# EAGLE design ckt1 (EAGLE 9.4.2)
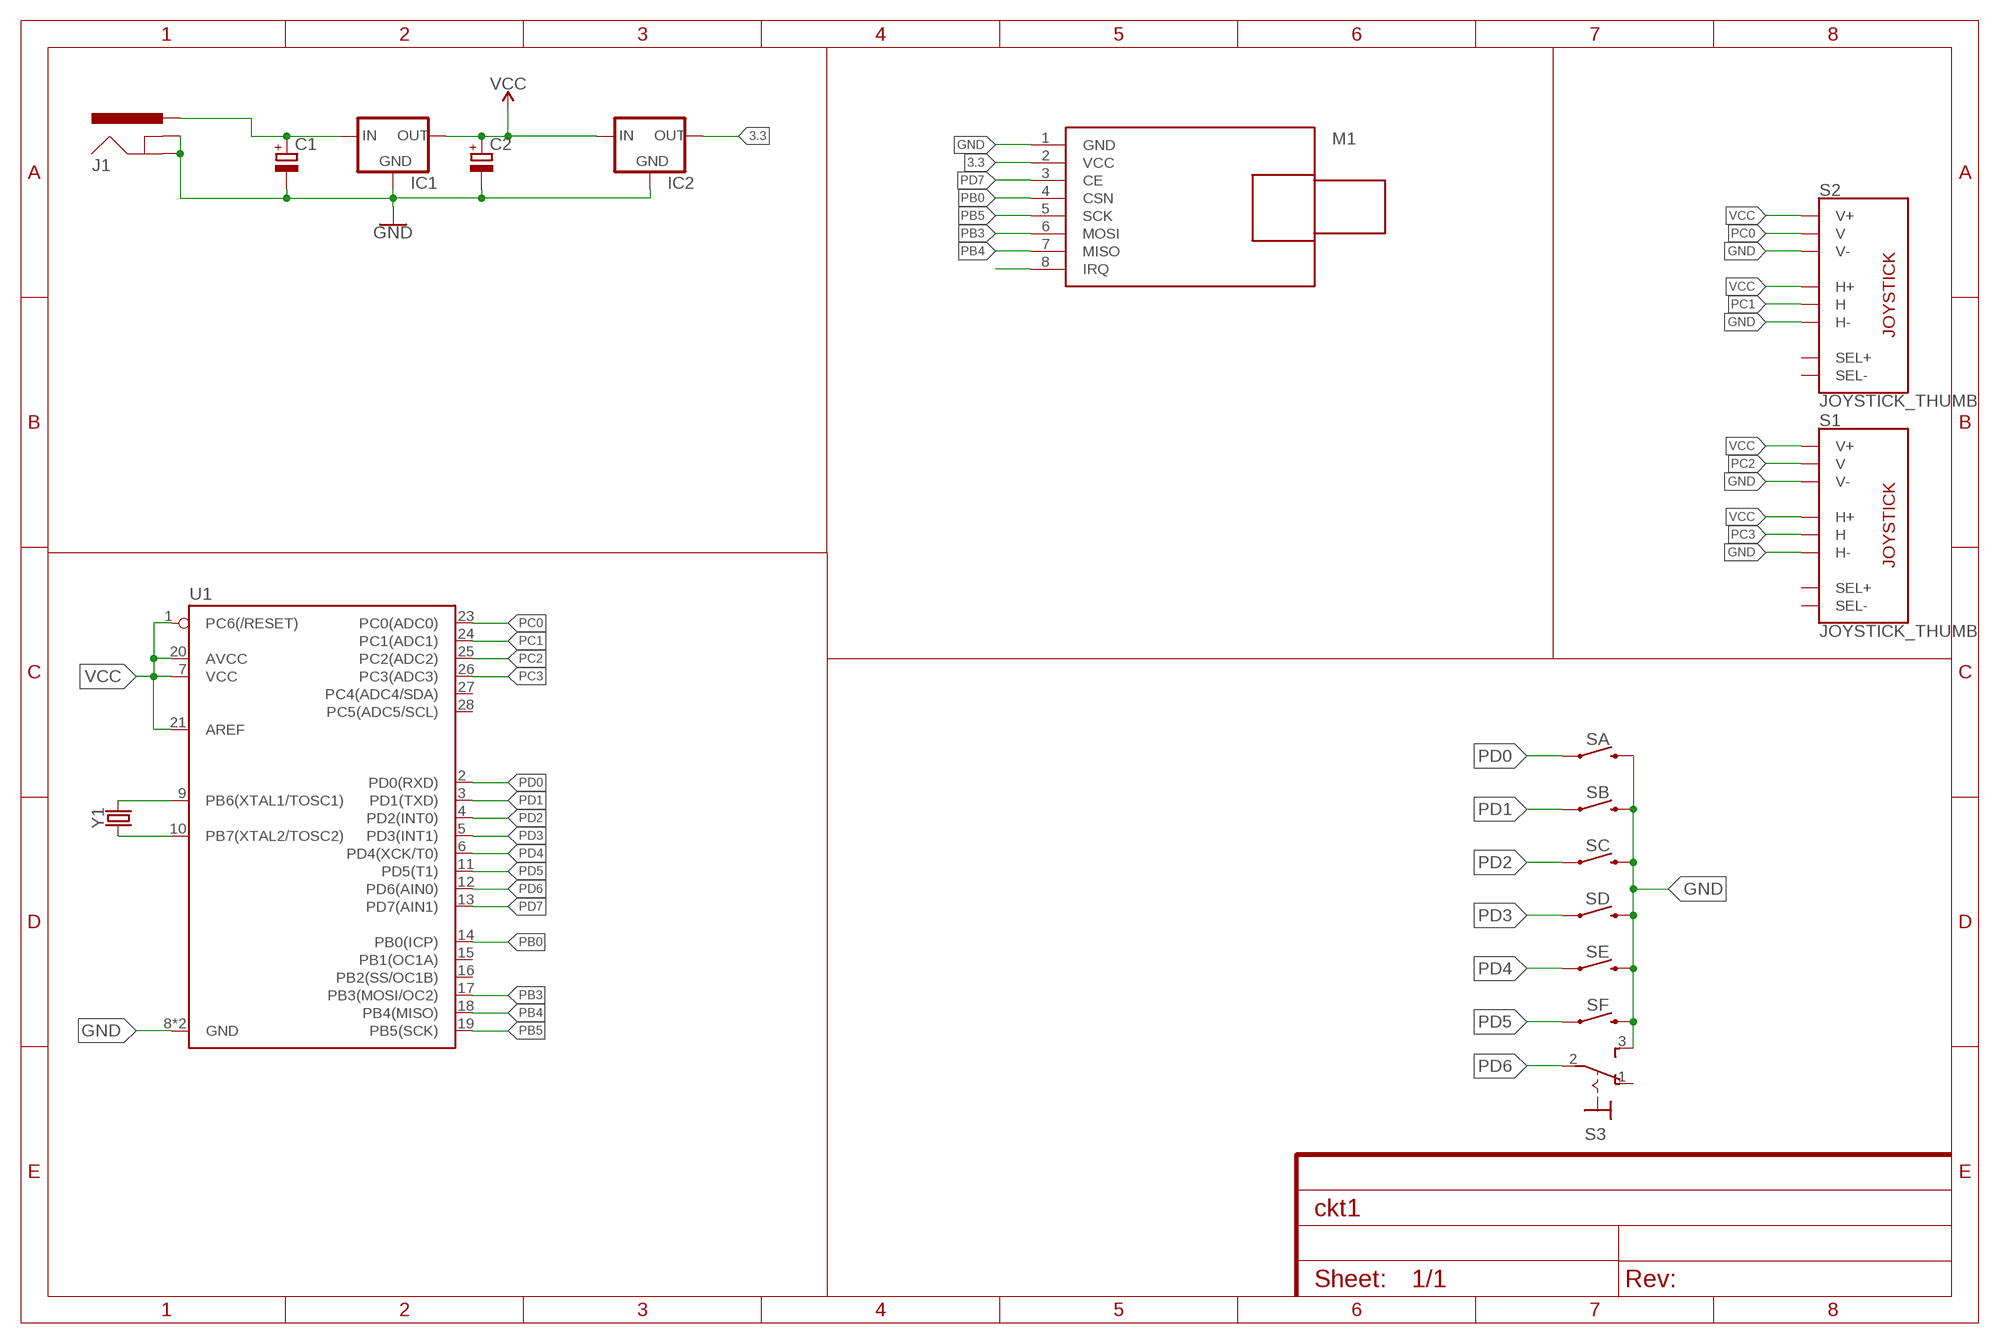
[diagram p0: schematic, sheet 1]

## Parts
C1  CPOL-EUE2-5  [E2-5]
C2  CPOL-EUE2-5  [E2-5]
IC1  78XXS  [78XXS]
IC2  78XXS  [78XXS]
J1  POWER_JACKSLT  [POWER_JACK_SLOT]
M1  WIRELESS-NRF24L01-PA-EXT  [WIRELESS-NRF24L01-PA-EXT]
S1  JOYSTICK_THUMB  [JOYSTICK]
S2  JOYSTICK_THUMB  [JOYSTICK]
S3  320-916  [320-916]
SA  MOMENTARY-SWITCH-SPST-PTH-6.0MM  [TACTILE_SWITCH_PTH_6.0MM]
SB  MOMENTARY-SWITCH-SPST-PTH-6.0MM  [TACTILE_SWITCH_PTH_6.0MM]
SC  MOMENTARY-SWITCH-SPST-PTH-6.0MM  [TACTILE_SWITCH_PTH_6.0MM]
SD  MOMENTARY-SWITCH-SPST-PTH-6.0MM  [TACTILE_SWITCH_PTH_6.0MM]
SE  MOMENTARY-SWITCH-SPST-PTH-6.0MM  [TACTILE_SWITCH_PTH_6.0MM]
SF  MOMENTARY-SWITCH-SPST-PTH-6.0MM  [TACTILE_SWITCH_PTH_6.0MM]
U1  328P  ATMEGA328P_PDIP  [DIP28]
Y1  CRYSTALPTH-HC49US  [HC49US]

## Nets
3.3: IC2.OUT M1.2(VCC)
GND: C1.- C2.- IC1.GND IC2.GND J1.GND@1(GNDBREAK) J1.GND@2(GND) M1.1(GND) S1.H3(H-) S1.V3(V-) S2.H3(H-) S2.V3(V-) S3.3(S) SA.3 SB.3 SC.3 SD.3 SE.3 SF.3 U1.8(GND) U1.22(GND)
N$1: U1.9(PB6(XTAL1/TOSC1)) Y1.2
N$2: C1.+ IC1.IN J1.PWR
N$3: U1.10(PB7(XTAL2/TOSC2)) Y1.1
N$8: M1.8(IRQ)
PB0: M1.4(CSN) U1.14(PB0(ICP))
PB3: M1.6(MOSI) U1.17(PB3(MOSI/OC2))
PB4: M1.7(MISO) U1.18(PB4(MISO))
PB5: M1.5(SCK) U1.19(PB5(SCK))
PC0: S2.V2(V) U1.23(PC0(ADC0))
PC1: S2.H2(H) U1.24(PC1(ADC1))
PC2: S1.V2(V) U1.25(PC2(ADC2))
PC3: S1.H2(H) U1.26(PC3(ADC3))
PD0: SA.1 U1.2(PD0(RXD))
PD1: SB.1 U1.3(PD1(TXD))
PD2: SC.1 U1.4(PD2(INT0))
PD3: SD.1 U1.5(PD3(INT1))
PD4: SE.1 U1.6(PD4(XCK/T0))
PD5: SF.1 U1.11(PD5(T1))
PD6: S3.2(P) U1.12(PD6(AIN0))
PD7: M1.3(CE) U1.13(PD7(AIN1))
VCC: C2.+ IC1.OUT IC2.IN S1.H1(H+) S1.V1(V+) S2.H1(H+) S2.V1(V+) U1.1(PC6(/RESET)) U1.7(VCC) U1.20(AVCC) U1.21(AREF)
Unconnected: S1.B1A(SEL+) S1.B2A(SEL-) S2.B1A(SEL+) S2.B2A(SEL-) S3.1(O) U1.15(PB1(OC1A)) U1.16(PB2(SS/OC1B)) U1.27(PC4(ADC4/SDA)) U1.28(PC5(ADC5/SCL))

## Library data of the parts
C1 C2 = rcl:CPOL-EU: POLARIZED CAPACITOR, European symbol; SPICEPREFIX: C
IC1 IC2 = v-reg:78XXS: VOLTAGE REGULATOR
J1 = SparkFun-Connectors:POWER_JACK: Power Jack Connector This is the standard 5.5mm barrel jack for power. The PTH is the most common, proven, reliable, footprint. The Slot footprint only works if the mill layer is transmitted to the PCB fab house so be warned. Here are the connectors we sell at SparkFun: DC Barrel Power Jack/Connector <https://www.sparkfun.com/products/119> (PRT-00119) DC Barrel Power Jack/Connector (SMD) <https://www.sparkfun.com/products/12748> (PRT-12748) DC Barrel Jack Adapter - Breadboard Compatible <https://www.sparkfun.com/products/10811> (PRT-10811) It is used on this SparkFun product (and many, many others): SparkFun RedBoard - Programmed with Arduino <https://www.sparkfun.com/products/12757> (DEV-12757) Also, if you need a mating power supply or connector, please check these out: Wall Adapter Power Supply - 9VDC 650mA <https://www.sparkfun.com/products/298> (TOL-00298) DC Barrel Jack Adapter - Male <https://www.sparkfun.com/products/10287> (PRT-10287); PROD_ID: PRT-00119
M1 = diy-modules:WIRELESS-NRF24L01-PA-EXT: 2.4 GHz Wireless Module based on NRF24L01 chip with preamplifier and external antenna Click here to find device on ebay.com <http://www.ebay.com/sch/nrf24l01+pa+lna+sma>
S1 S2 = SparkFun-Switches:JOYSTICK_THUMB: Analog Thumb Joystick This is a joystick very similar to the ‘analog’ joysticks on PS2 (PlayStation 2) controllers. Directional movements are simply two potentiometers - one for each axis. Pots are ~10k each. This joystick also has a select button that is actuated when the joystick is pressed down. SparkFun Products Thumb Joystick <https://www.sparkfun.com/products/9032> (COM-09032) SparkFun Thumb Joystick Breakout <https://www.sparkfun.com/products/9110> (BOB-09110) SparkFun Joystick Shield Kit <https://www.sparkfun.com/products/9760> (DEV-09760); PROD_ID: COMP-09744; SF_SKU: COM-09032
S3 = switch:320-916: TOGGLE SWITCH distributor RS Components
SA SB SC SD SE SF = SparkFun-Switches:MOMENTARY-SWITCH-SPST: Momentary Switch (Pushbutton) - SPST Normally-open (NO) SPST momentary switches (buttons, pushbuttons). Variants PTH-12MM - 12mm square, through-hole Momentary Pushbutton Switch - 12mm Square <https://www.sparkfun.com/products/9190> (COM-09190) PTH-6.0MM, PTH-6.0MM-KIT - 6.0mm square, through-hole Mini Pushbutton Switch <https://www.sparkfun.com/products/97> (COM-00097) KIT package intended for soldering kit's - only one side of pads' copper is exposed. PTH-RIGHT-ANGLE-KIT - Right-angle, through-hole Right Angle Tactile Button <https://www.sparkfun.com/products/10791> - Used on SparkFun BigTime Watch Kit <https://www.sparkfun.com/products/11734> SMD-12MM - 12mm square, surface-mount Tactile Button - SMD (12mm) <https://www.sparkfun.com/products/12993> (COM-12993) Used on SparkFun PicoBoard <https://www.sparkfun.com/products/11888> SMD-4.5MM - 4.5mm Square Trackball Switch Used on SparkFun Blackberry Trackballer Breakout <https://www.sparkfun.com/products/13169> SMD-4.6MMX2.8MM - 4.60mm x 2.80mm, surface mount Used on SparkFun SAMD21 Mini Breakout <https://www.sparkfun.com/products/13664> SMD-5.2MM, SMD-5.2-REDUNDANT - 5.2mm square, surface-mount Mini Pushbutton Switch - SMD <https://www.sparkfun.com/products/8720> (COM-08720) Used on Arduino Pro Mini <https://www.sparkfun.com/products/11114> REDUNDANT package connects both switch circuits together SMD-6.0X3.5MM - 6.0 x 3.5mm, surface mount Momentary Reset Switch SMD <https://www.sparkfun.com/products/8229> (COM-08229) SMD-6.2MM-TALL - 6.2mm square, surface mount Tactile Button - SMD (6mm) <https://www.sparkfun.com/products/12992> Used on SparkFun Digital Sandbox <https://www.sparkfun.com/products/12651> SMD-RIGHT-ANGLE - Right-angle, surface mount Used on SparkFun Block for Intel® Edison - Arduino <https://www.sparkfun.com/products/13036>; PROD_ID: SWCH-08441; SF_SKU: COM-00097
U1 = SparkFun-IC-Microcontroller:ATMEGA328P_PDIP: Atmel 328P Through hole ATMEGA328P uC used in the Arduino 32kb flash, 1k EEPROM, 2k SRAM Datasheet <http://www.sparkfun.com/datasheets/Components/SMD/ATMega328.pdf> SparkFun Products Storefront component: AVR 28 Pin 20MHz 32K 6A/D - ATMega328P <https://www.sparkfun.com/products/9061> (COM-09061) SparkFun Simon Says - Through-Hole Soldering Kit <https://www.sparkfun.com/products/10547> (KIT-10547) SparkFun Learn to Solder - Simon Says <https://www.sparkfun.com/products/13708> (KIT-13708) SparkFun BigTime Watch Kit <https://www.sparkfun.com/products/11734> (KIT-11734) SparkFun ClockIt <https://www.sparkfun.com/products/10930> (KIT-10930) SparkFun Serial Enabled LCD Kit <https://www.sparkfun.com/products/10097> (LCD-10097) SparkFun Simon Tilts - Through Hole Soldering Kit <https://www.sparkfun.com/products/12634> (KIT-12634) SparkFun Frequency Counter Kit <https://www.sparkfun.com/products/10140> (KIT-10140) FabFM Radio Kit <https://www.sparkfun.com/products/11043> (KIT-11043) SparkFun Binary Blaster Kit <https://www.sparkfun.com/products/12037> (KIT-12037) SparkFun Metro-Gnome <https://www.sparkfun.com/products/9236> (KIT-09236) ATmega328 with Arduino Optiboot (Uno) <https://www.sparkfun.com/products/10524> (DEV-10524); PROD_ID: IC-09136
Y1 = SparkFun-Clocks:CRYSTAL: Crystals (Generic) These are passive quartz crystals, which can be used as a clock source for a microcontroller. Crystal's are two-terminal devices. They require external "load" capacitors to generate an oscillating signal.

## Board
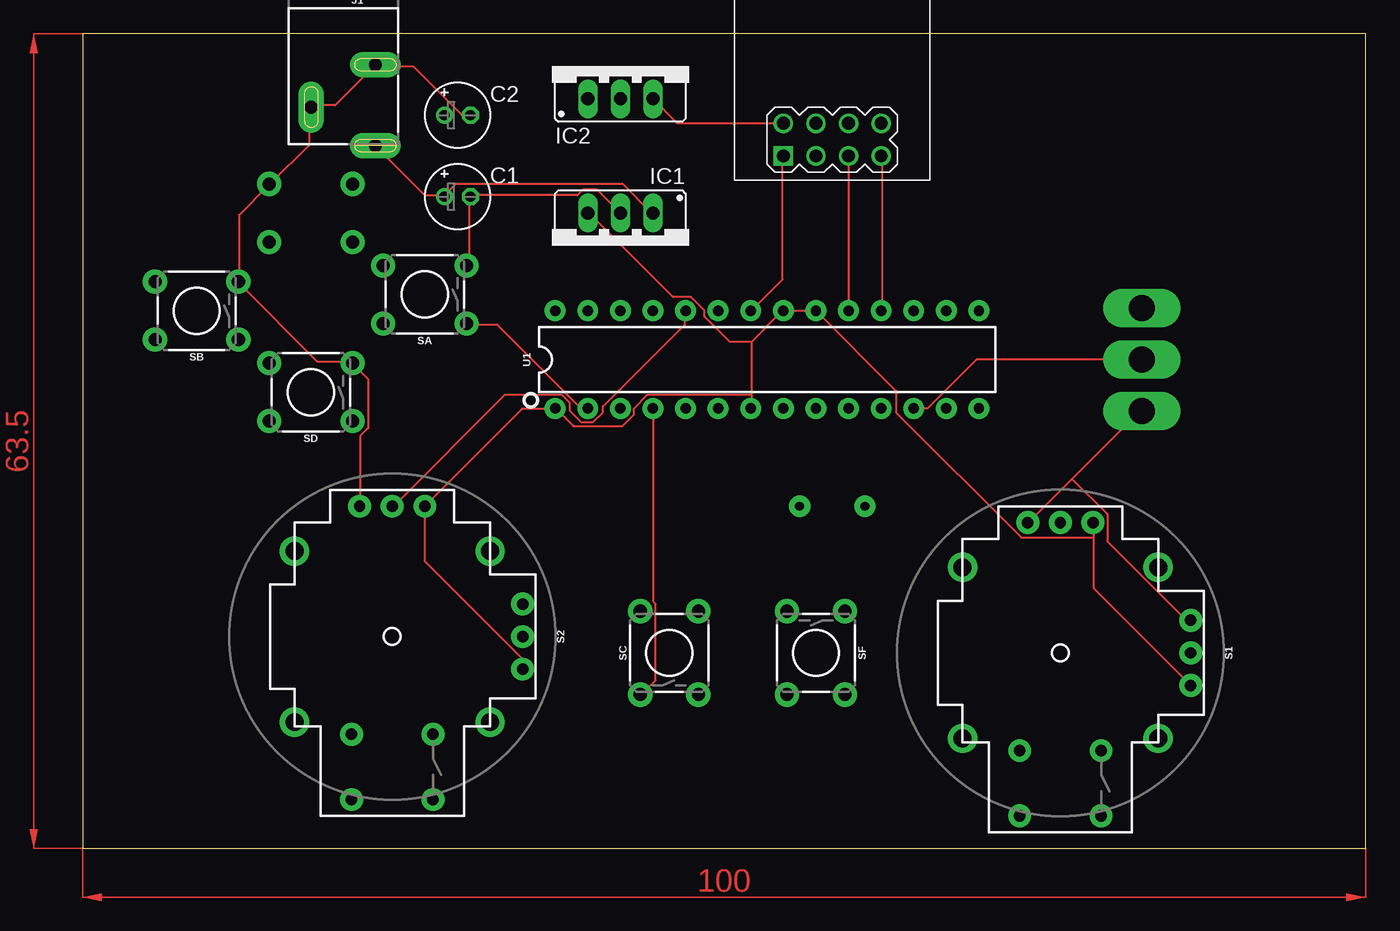
[diagram p1: board, top side]
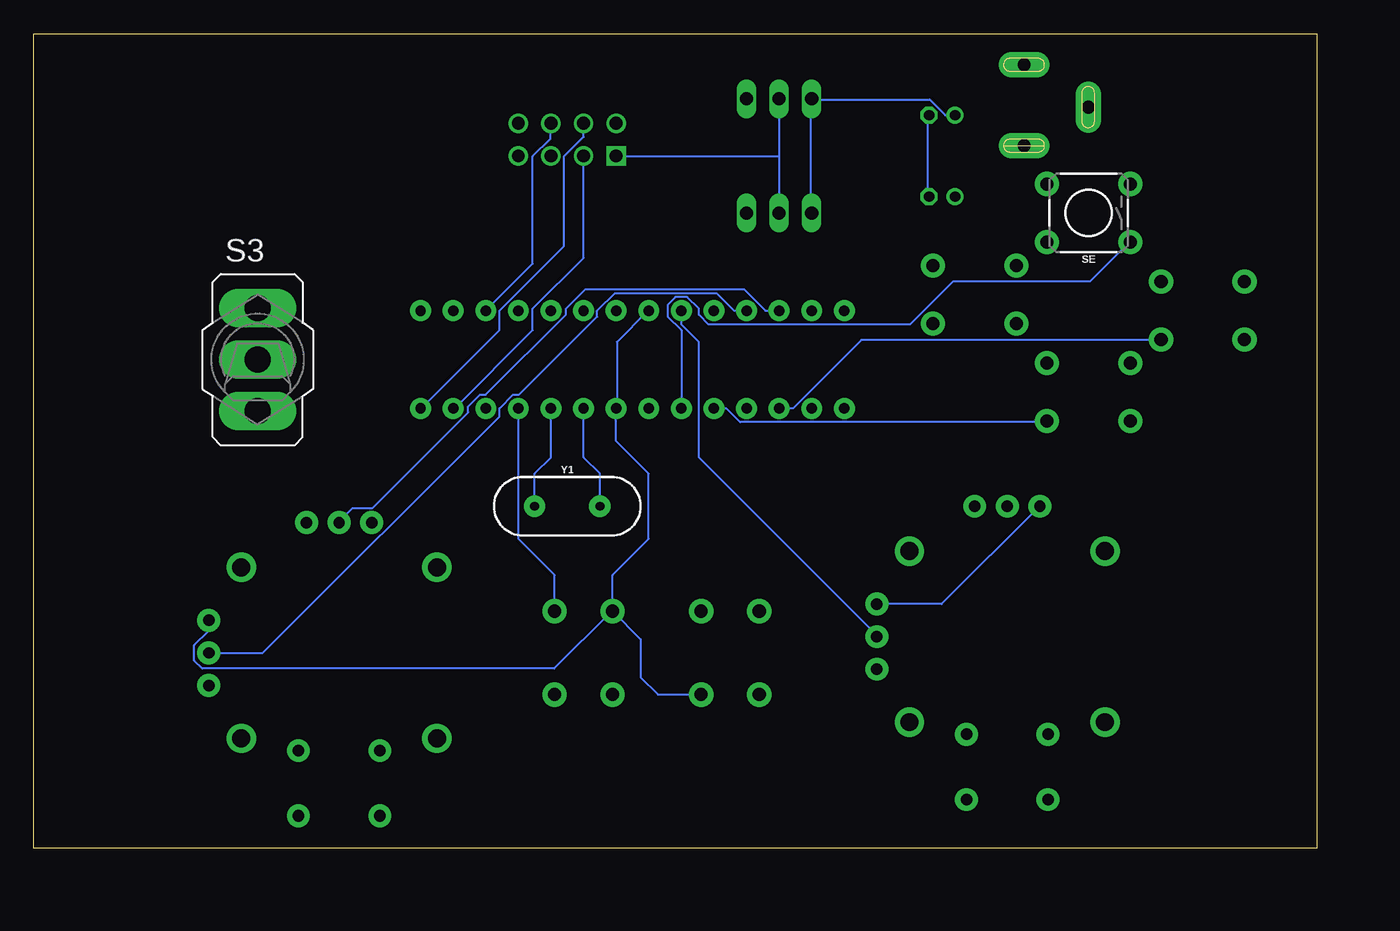
[diagram p2: board, bottom side, seen from below]

Size 100 x 63.49 mm. Coordinates in mm from the lower left corner, seen from the top.
Outline: 0,0 100,0 100,63.49 0,63.49 0,0
Copper layers (1*16): Top 0.035mm / dielectric 1.5mm / Bottom 0.035mm
Design rules "default": minimum track width 6mil, minimum drill 0.35mm, track to track 6mil, track to pad 6mil, pad to pad 6mil, via to via 6mil, smd to smd 6mil, copper to edge 40mil, drill to drill 6mil, minimum pad ring 10mil, minimum via ring 8mil, stop-mask expansion 4mil, vias tented up to drill 0mil, thermal gap 10mil

### Footprints (pad centres in the part's own frame; a part is rotated, then mirrored left to right if it is on the bottom)
E2-5 = drill 0.813 pad 1.27: + -1.016,0 | drill 0.813 pad 1.27 octagon: - 1.016,0
78XXS = drill 1.016 long: GND 0,-2.54; IN -2.54,-2.54; OUT 2.54,-2.54
POWER_JACK_SLOT = drill 1 pad 2 long: GND@1 2.58,7.5; GND@2 7.58,10.8; PWR 2.58,13.8
WIRELESS-NRF24L01-PA-EXT = drill 1 square: 1 -18.415,3.81 | drill 1: 2 -15.875,3.81; 3 -18.415,1.27; 4 -15.875,1.27; 5 -18.415,-1.27; 6 -15.875,-1.27; 7 -18.415,-3.81; 8 -15.875,-3.81
JOYSTICK = drill 0.9 pad 1.778: B1A -3.175,12.7; B1B 3.175,12.7; B2A -3.175,7.62; B2B 3.175,7.62 | drill 0.889 pad 1.778: H1 -2.54,-10.16; H2 0,-10.16; H3 2.54,-10.16; V1 -10.16,2.54; V2 -10.16,0; V3 -10.16,-2.54 | drill 1.397 pad 2.286: MOUNT1 -7.62,6.668; MOUNT2 -7.62,-6.668; MOUNT3 7.62,-6.668; MOUNT4 7.62,6.668
320-916 = drill 2.007 long: 1 0,4.013; 2 0,0; 3 0,-4.013
TACTILE_SWITCH_PTH_6.0MM = drill 1.016 pad 1.88: 1 -3.251,2.261; 2 3.251,2.261; 3 -3.251,-2.261; 4 3.251,-2.261
DIP28 = drill 0.813 pad 1.626: 1 -16.51,-3.81; 2 -13.97,-3.81; 3 -11.43,-3.81; 4 -8.89,-3.81; 5 -6.35,-3.81; 6 -3.81,-3.81; 7 -1.27,-3.81; 8 1.27,-3.81; 9 3.81,-3.81; 10 6.35,-3.81; 11 8.89,-3.81; 12 11.43,-3.81; 13 13.97,-3.81; 14 16.51,-3.81; 15 16.51,3.81; 16 13.97,3.81; 17 11.43,3.81; 18 8.89,3.81; 19 6.35,3.81; 20 3.81,3.81; 21 1.27,3.81; 22 -1.27,3.81; 23 -3.81,3.81; 24 -6.35,3.81; 25 -8.89,3.81; 26 -11.43,3.81; 27 -13.97,3.81; 28 -16.51,3.81
HC49US = drill 0.7 pad 1.651: 1 -2.54,0; 2 2.54,0

### Placement (x,y rotation side)
C1  29.21,50.8 0 top
C2  29.21,57.15 0 top
IC1  41.91,46.99 180 top
IC2  41.91,60.96 0 top
J1  25.4,68.58 180 top
M1  58.42,72.39 90 top
S1  76.2,15.24 180 top
S2  24.13,16.51 180 top
S3  82.55,38.1 0 bottom
SA  26.67,43.18 180 top
SB  8.89,41.91 180 top
SC  45.72,15.24 90 top
SD  17.78,35.56 180 top
SE  17.78,49.53 180 bottom
SF  57.15,15.24 270 top
U1  53.34,38.1 0 top
Y1  58.42,26.67 0 bottom

### Tracks (layer width: path | path; a pad name or v marks a point on that pad's centre or on a via)
3.3
  Top 0.152: IC2.OUT 46.33,56.54 54.56,56.54 M1.2
GND
  Top 0.152: S2.H3 21.64,26.67 21.64,32.16 22.25,32.77 22.25,36.58 21.03,37.8 SD.3 21.03,37.95 18.29,37.95 12.19,44.04 SB.3 12.19,44.2 12.19,49.38 14.48,51.66 SE.3 14.63,51.82 17.68,54.86 17.68,57.76 J1.GND@2 17.83,57.91 19.66,57.91 22.71,60.96 J1.GND@1 22.86,60.96 25.76,60.96 29.57,57.15 C2.- | SA.3 30.02,45.57 30.18,45.72 30.18,50.75 C1.- 30.33,50.9 38.56,50.9 39.01,51.36 40.08,51.36 IC1.GND | 77.11,28.8 82.45,34.14 S3.3 | 77.11,28.8 73.76,25.45 S1.H3 | 77.11,28.8 79.86,26.06 79.86,23.93 85.95,17.83 86.26,17.83 S1.V3 | M1.1 54.56,53.95 54.56,44.35 52.12,41.91 U1.22
  Bottom 0.152: S2.V3 29.26,19.05 21.64,26.67 S2.H3 | C2.- 30.33,57.15 30.33,50.9 C1.- | IC2.GND 41.91,53.95 | 41.91,53.95 IC1.GND | U1.22 52.12,41.91 54.56,39.47 54.56,34.29 U1.8 54.61,31.75 52.07,29.21 52.07,24.13 54.89,21.31 SF.3 | 41.91,53.95 54.56,53.95 M1.1 | S1.V3 86.41,17.68 86.41,16.92 87.48,15.85 87.48,14.63 86.87,14.02 59.44,14.02 55.02,18.44 SF.3 | SF.3 52.7,16.31 52.7,13.34 51.36,11.99 SC.3
N$1
  Bottom 0.152: Y1.2 55.88,29.21 57.15,30.48 U1.9
N$2
  Top 0.152: 28.19,50.9 26.67,50.9 22.86,54.71 J1.PWR | 28.19,50.9 29.11,51.82 42.06,51.82 44.35,49.53 IC1.IN | 28.19,50.9 C1.+
N$3
  Bottom 0.152: Y1.1 60.96,29.21 59.69,30.48 U1.10
PB0
  Bottom 0.152: M1.4 57.15,55.47 58.67,53.95 58.67,46.94 63.7,41.91 63.7,40.39 69.8,34.29 U1.14
PB3
  Bottom 0.152: U1.17 61.11,45.57 61.11,53.95 59.74,55.32 59.74,56.39 M1.6
PB4
  Top 0.152: M1.7 62.33,53.95 62.33,41.91 U1.18
PB5
  Top 0.152: M1.5 59.74,53.95 59.74,41.91 U1.19
PC0
  Bottom 0.152: U1.23 49.53,40.84 48.16,39.47 48.16,30.48 34.29,16.61 S2.V2
PC1
  Top 0.152: U1.24 46.94,41.91 46.94,40.84 40.54,34.44 40.54,33.98 39.78,33.22 38.86,33.22 37.95,34.14 37.95,34.75 37.34,35.36 32.92,35.36 24.23,26.67 S2.H2
PC2
  Bottom 0.152: U1.25 45.41,41.91 46.79,43.28 54.71,43.28 56.08,41.91 56.08,41.45 62.18,35.36 62.64,35.36 63.7,34.29 63.7,33.68 82.14,15.24 S1.V2
PC3
  Bottom 0.152: U1.26 42.98,41.91 44.65,43.59 57,43.59 58.52,42.06 58.52,41.6 64.77,35.36 65.23,35.36 66.14,34.44 66.14,33.98 73.61,26.52 75.13,26.52 76.2,25.45 S1.H2
PD0
  Top 0.152: U1.2 38.86,34.29 32.31,40.84 30.02,40.84 SA.1
PD1
  Bottom 0.152: U1.3 40.84,34.29 35.51,39.62 12.19,39.62 SB.1
PD2
  Top 0.152: U1.4 44.5,34.29 44.5,19.2 44.65,19.05 44.65,13.11 43.59,12.04 SC.1
PD3
  Bottom 0.152: U1.5 46.02,34.29 44.96,33.22 21.03,33.22 SD.1
PD4
  Bottom 0.152: U1.6 49.53,40.39 50.6,41.45 50.6,42.37 49.99,42.98 49.07,42.98 48.16,42.06 48.16,41.6 47.4,40.84 31.7,40.84 28.35,44.2 17.68,44.2 14.63,47.24 SE.1
PD5
  Bottom 0.152: SF.1 59.41,21.31 62.23,24.13 U1.11
PD6
  Top 0.152: U1.12 65.84,34.29 69.65,38.1 S3.2
PD7
  Bottom 0.152: M1.3 57.15,46.02 61.11,42.06 61.11,40.39 67.21,34.29 U1.13
VCC
  Top 0.152: 78.79,24.23 78.79,20.27 S1.V1 | 78.79,24.23 78.79,25.3 S1.H1 | 52.12,39.47 52.12,35.36 | 52.12,35.36 52.12,34.29 U1.7 | 52.12,39.47 54.56,41.91 U1.21 U1.20 63.4,35.66 63.4,33.98 73.15,24.23 78.79,24.23 | S2.V1 34.29,14.78 26.67,22.4 S2.H1 34.29,34.29 U1.1 36.88,34.29 38.25,32.92 42.06,32.92 42.98,33.83 42.98,34.29 44.04,35.36 52.12,35.36 | 52.12,39.47 50.44,39.47 48.46,41.45 48.46,41.91 47.4,42.98 46.02,42.98 39.47,49.53 IC1.OUT
  Bottom 0.152: C2.+ 28.96,57.15 30.18,58.37 39.32,58.37 IC2.IN 39.47,58.37 39.47,49.53 IC1.OUT
(copper drawn outside any net)
  shapes: Top area x2